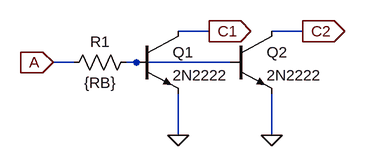
[diagram p0: schematic iilin2.asc]
iilin2.asc, the LTspice schematic file:
Version 4
SHEET 1 880 680
WIRE 240 192 192 192
WIRE 384 192 336 192
WIRE 32 240 0 240
WIRE 128 240 112 240
WIRE 272 240 128 240
WIRE 192 352 192 288
WIRE 336 352 336 288
FLAG 192 352 0
FLAG 240 192 C1
IOPIN 240 192 Out
FLAG 0 240 A
IOPIN 0 240 In
FLAG 336 352 0
FLAG 384 192 C2
IOPIN 384 192 Out
SYMBOL npn 128 192 R0
SYMATTR InstName Q1
SYMATTR Value 2N2222
SYMBOL res 16 256 R270
WINDOW 0 32 56 VTop 2
WINDOW 3 0 56 VBottom 2
SYMATTR InstName R1
SYMATTR Value {RB}
SYMBOL npn 272 192 R0
SYMATTR InstName Q2
SYMATTR Value 2N2222

The netlist it stands for:
* iilin2.asc
Q1 C1 N001 0 0 2N2222
R1 A N001 {RB}
Q2 C2 N001 0 0 2N2222
.model NPN NPN
.model PNP PNP
.lib standard.bjt
.backanno
.end